# EasyEDA Pro project ProProject_运放实验_2024-09-24.epro, board PCB4_1
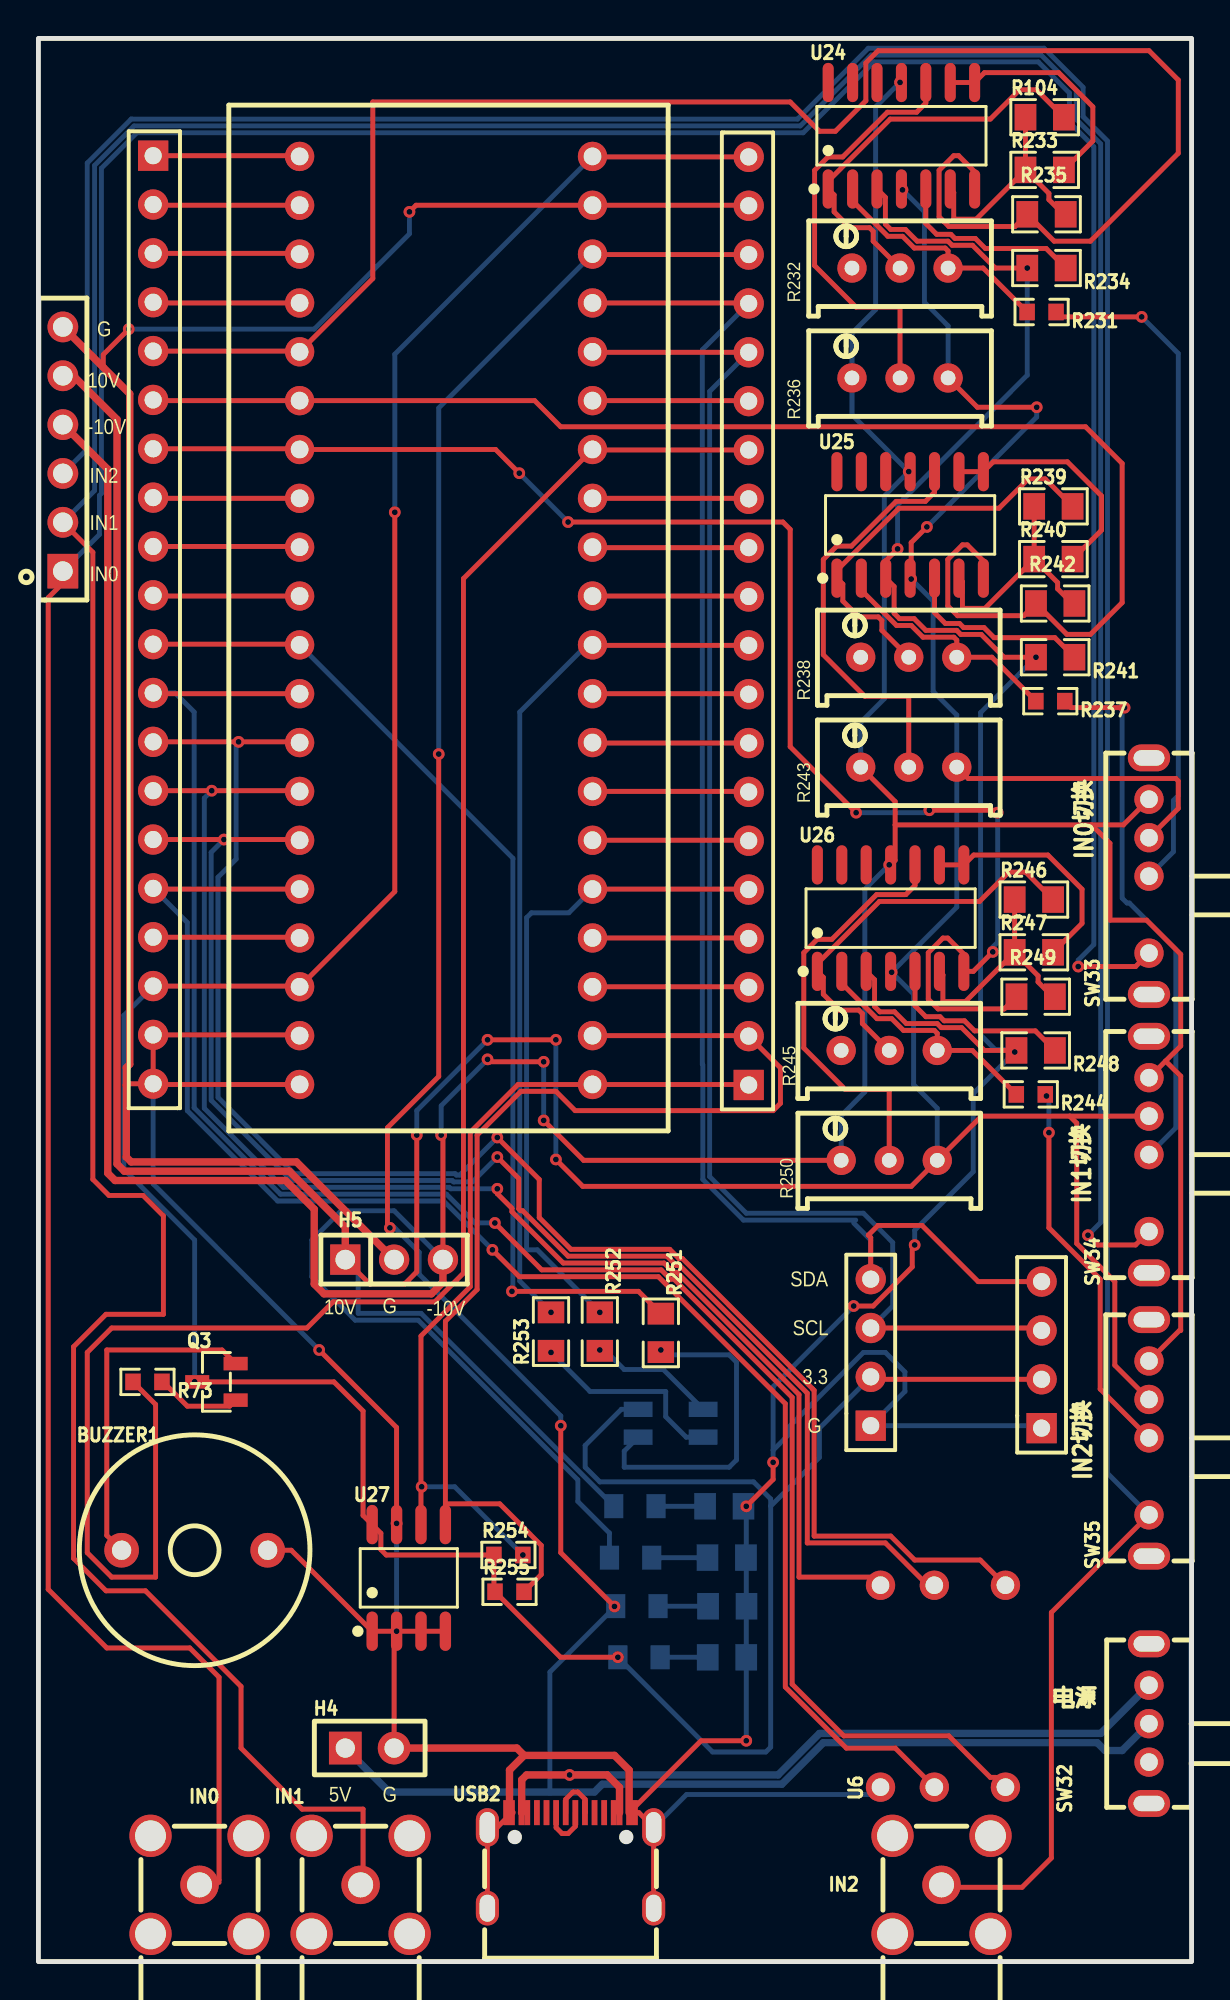
[diagram p5: board, top side]
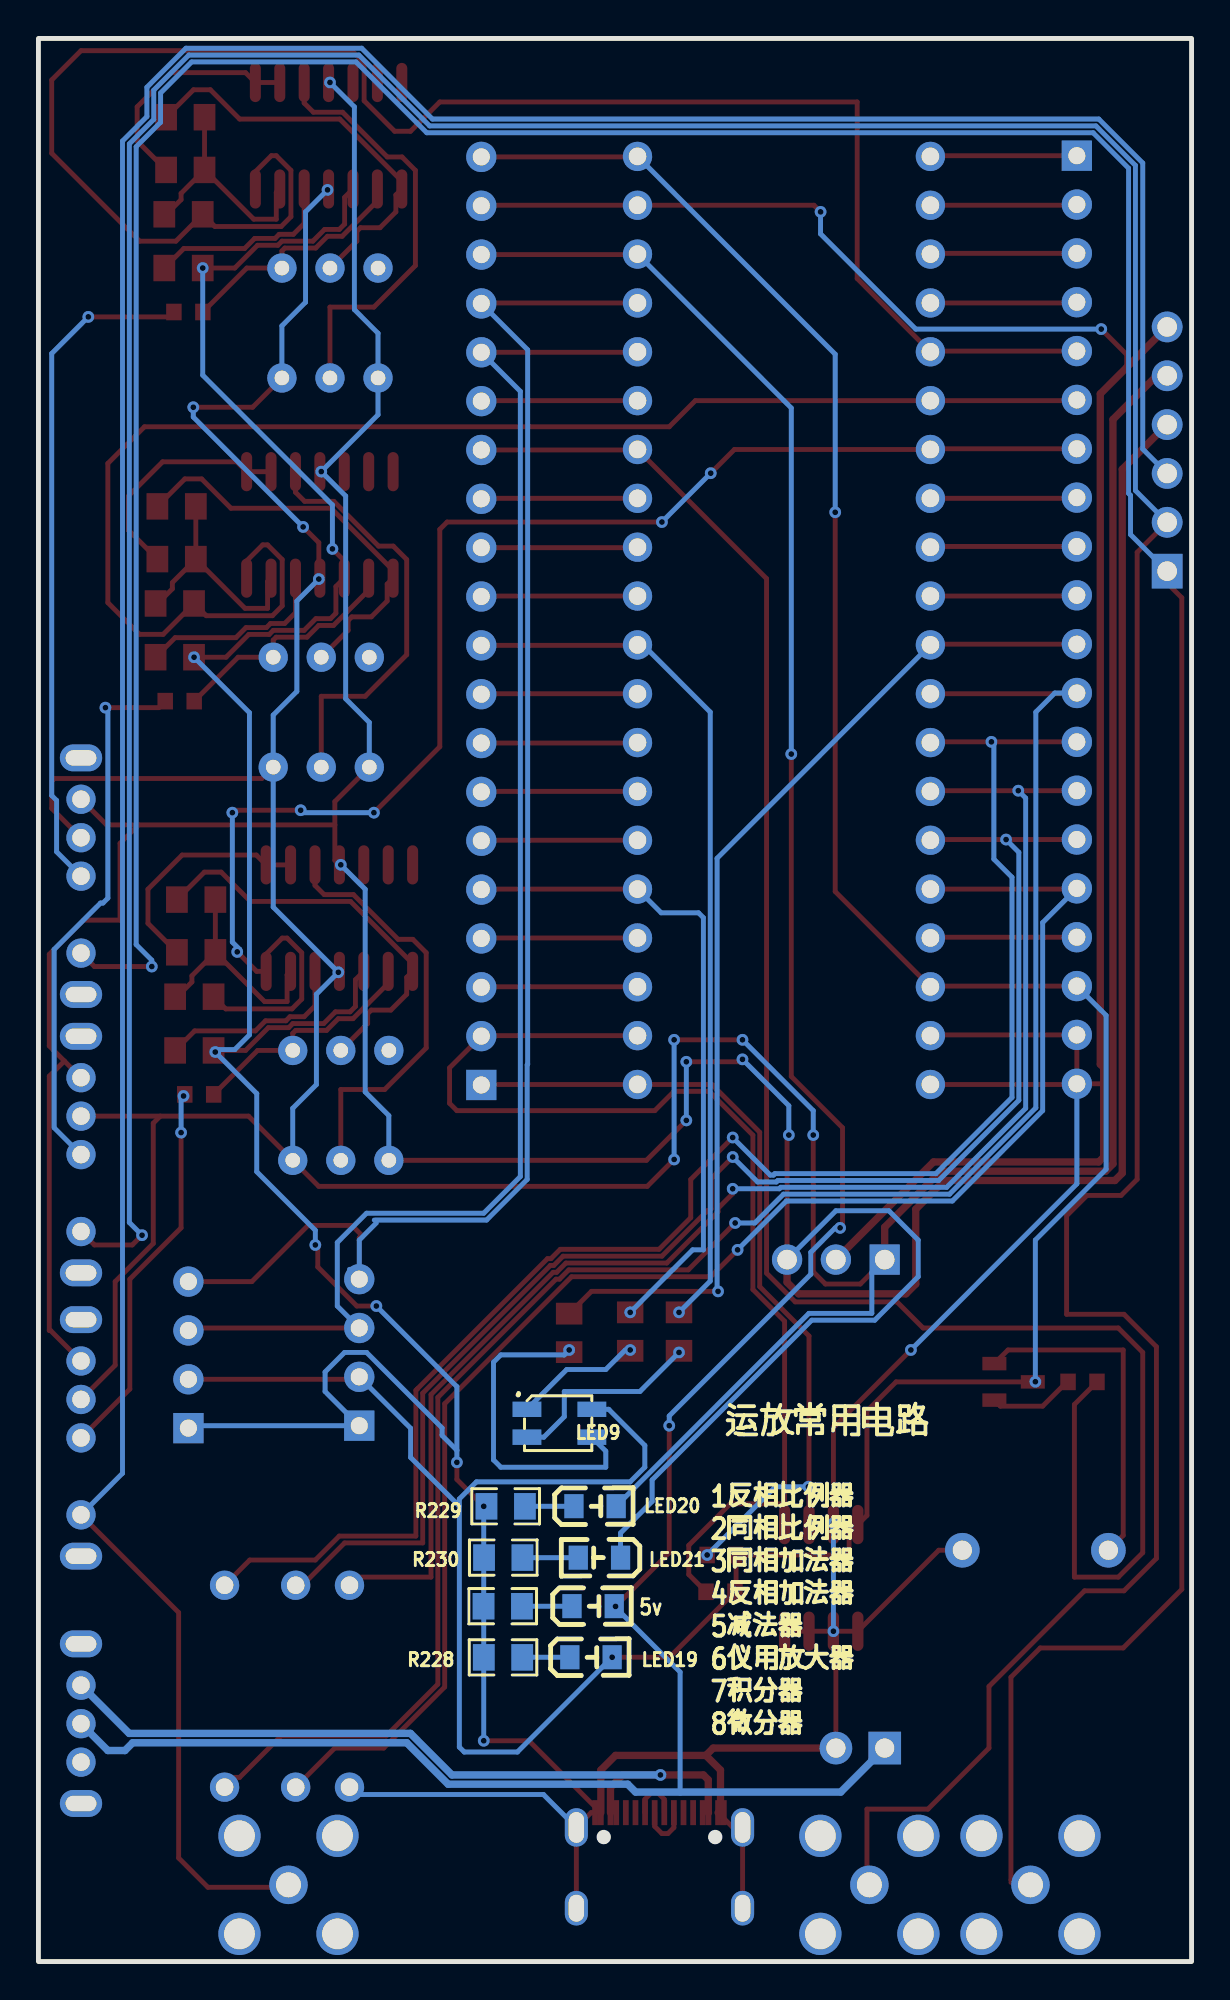
[diagram p6: board, bottom side, seen from below]

Outline 60 x 100 mm; copper layers: Top Layer, Bottom Layer. Coordinates in mm from the lower left corner of the outline.
Outline path: rectangle 0,100 60,0
Stack: Top Layer 0.035mm - / Dielectric1 1.51mm FR4 er 4.5 / Bottom Layer 0.035mm -

## Design rules (mm)
template: JLCPCB Capability(Two Layers Board)
spacing copperThickness1oz (default): track to track 0.102, other pairs 0.152 to 0.3
spacing copperThickness2oz: track to track 0.203, other pairs 0.152 to 0.3
track width copperThickness1oz (default): min 0.127, default 0.254, max 2.54
track width copperThickness2oz: min 0.203, default 0.254, max 2.54
differential pair differentialPair (default): width min 0.127, default 0.254, max 2.54; gap min 0.152, default 0.152
via viaSize (default): diameter min 0.5, default 0.61, max 10; hole min 0.3, default 0.305, max 6.3

## Placement (name value [footprint] x y rotation side)
BUZZER1  2.3kHz  [BUZ-TH_BD12.0-P7.60-D0.6-FD]  8.13 21.39 0 top
H2  PM254V-11-06-H85  [HDR-TH_6P-P2.54-V-F]  1.27 78.65 90 top
H3  HDR-F-2.54_1x4  [HDR-F-2.54_1X4]  43.31 31.67 90 top
H3#2  -  [HDR-F-2.54_1X4]  52.2 31.55 90 top
H4  -  [HDR-TH_2P-P2.54-V-F]  17.24 11.1 0 top
H5  -  [HDR-TH_3P-P2.54-V-F]  18.51 36.5 0 top
IN0  BWSMA-KWE-Z001  [SMA-TH_BWSMA-KWE-Z001]  8.38 3.99 270 top
IN1  BWSMA-KWE-Z001  [SMA-TH_BWSMA-KWE-Z001]  16.76 3.99 270 top
IN2  BWSMA-KWE-Z001  [SMA-TH_BWSMA-KWE-Z001]  46.99 3.99 270 top
J1  HDR-M-2.54_1x20  [HDR-M-2.54_1X20]  36.96 69.71 90 top
J2  HDR-M-2.54_1x20  [HDR-M-2.54_1X20]  5.97 69.77 270 top
LED9  LED-RGB-3528  [LED 3528-4PIN]  32.89 27.99 0 bottom
LED18  -  [LED_0805]  31.09 18.48 180 bottom
LED19  -  [LED_0805]  31.2 15.82 180 bottom
LED20  -  [LED_0805]  30.99 23.67 180 bottom
LED21  -  [LED_0805]  30.86 21.01 0 bottom
Q3  S8550  [SOT-23-3_L2.9-W1.3-P1.90-LS2.4-BR]  9.26 30.14 0 top
R73  1kΩ  [R0603]  5.67 30.14 180 top
R104  1k  [R0805]  52.36 95.91 0 top
R227  5k  [R0805]  35.84 18.48 180 bottom
R228  5k  [R0805]  35.83 15.82 180 bottom
R229  5k  [R0805]  35.69 23.67 180 bottom
R230  5k  [R0805]  35.81 21.01 180 bottom
R231  3.3kΩ  [R0603]  52.2 85.78 180 top
R232  1kΩ  [RES-ADJ-TH_3P-L10.0-W10.0-P2.50-BL-BS]  44.83 88.06 90 top
R233  1k  [R0805]  52.36 93.16 0 top
R234  1k  [R0805]  52.45 88.06 180 top
R235  1k  [R0805]  52.45 90.86 0 top
R236  5kΩ  [RES-ADJ-TH_3P-L9.5-W4.85-P2.50-BL-BS]  44.83 82.35 90 top
R237  3.3kΩ  [R0603]  52.65 65.54 180 top
R238  1kΩ  [RES-ADJ-TH_3P-L10.0-W10.0-P2.50-BL-BS]  45.28 67.83 90 top
R239  1k  [R0805]  52.81 75.67 0 top
R240  1k  [R0805]  52.81 72.93 0 top
R241  1k  [R0805]  52.9 67.83 180 top
R242  1k  [R0805]  52.9 70.62 0 top
R243  5kΩ  [RES-ADJ-TH_3P-L9.5-W4.85-P2.50-BL-BS]  45.28 62.11 90 top
R244  3.3kΩ  [R0603]  51.63 45.09 180 top
R245  1kΩ  [RES-ADJ-TH_3P-L10.0-W10.0-P2.50-BL-BS]  44.27 47.38 90 top
R246  1k  [R0805]  51.79 55.22 0 top
R247  1k  [R0805]  51.79 52.48 0 top
R248  1k  [R0805]  51.89 47.38 180 top
R249  1k  [R0805]  51.89 50.17 0 top
R250  5kΩ  [RES-ADJ-TH_3P-L9.5-W4.85-P2.50-BL-BS]  44.27 41.66 90 top
R251  1k  [R0805]  32.38 32.69 270 top
R252  1k  [R0805]  29.21 32.76 270 top
R253  1k  [R0805]  26.67 32.76 90 top
R254  10kΩ  [R0603]  24.45 21.14 0 top
R255  10kΩ  [R0603]  24.51 19.23 0 top
SW32  SK12D07VG4  [SW-TH_SK12D07VG4]  57.78 12.37 90 top
SW33  SK13D07VG4  [SW-TH_SK13D07VG4]  57.78 56.44 90 top
SW34  SK13D07VG4  [SW-TH_SK13D07VG4]  57.78 41.96 90 top
SW35  SK13D07VG4  [SW-TH_SK13D07VG4]  57.78 27.23 90 top
U6  -  [直插五向开关]  43.81 9.07 90 top
U23  STM32最小系统-fh  [STM32最小系统板]  20.7 69.74 90 top
U24  LM324DT  [SOIC-14_L8.7-W3.9-P1.27-LS6.0-BL]  44.9 94.94 0 top
U25  LM324DT  [SOIC-14_L8.7-W3.9-P1.27-LS6.0-BL]  45.36 74.7 0 top
U26  LM324DT  [SOIC-14_L8.7-W3.9-P1.27-LS6.0-BL]  44.34 54.26 0 top
U27  M24C02-WMN6TP  [SOIC-8_L4.9-W3.9-P1.27-LS6.0-BL]  19.27 19.95 0 top
USB2  -  [USB-C_SMD-TYPE-C-31-M-12]  27.69 5.26 0 top

## Footprints (pads in the part's own frame, mm; a bottom-side part is the same pattern mirrored in y, then rotated)
BUZ-TH_BD12.0-P7.60-D0.6-FD
  round 1.8 hole 1: 1(-3.8,0) 2(3.8,0)
HDR-F-2.54_1X4
  rect 1.575x1.575 hole 0.889: 1(-3.81,0)
  round 1.575 hole 0.889: 2(-1.27,0) 3(1.27,0) 4(3.81,0)
HDR-M-2.54_1X20
  rect 1.575x1.575 hole 0.889: 1(-24.13,0)
  round 1.575 hole 0.889: 2(-21.59,0) 3(-19.05,0) 4(-16.51,0) 5(-13.97,0) 6(-11.43,0) 7(-8.89,0) 8(-6.35,0) 9(-3.81,0) 10(-1.27,0) 11(1.27,0) 12(3.81,0) 13(6.35,0) 14(8.89,0) 15(11.43,0) 16(13.97,0) 17(16.51,0) 18(19.05,0) 19(21.59,0) 20(24.13,0)
HDR-TH_2P-P2.54-V-F
  rect 1.7x1.7 hole 1: 1(-1.27,0)
  round 1.7 hole 1: 2(1.27,0)
HDR-TH_3P-P2.54-V-F
  rect 1.575x1.575 hole 1.02: 1(-2.54,0)
  round 1.575 hole 1.02: 2(0,0) 3(2.54,0)
HDR-TH_6P-P2.54-V-F
  rect 1.8x1.6 hole 1.02: 1(-6.35,0)
  round 1.6 hole 1.02: 2(-3.81,0) 3(-1.27,0) 4(1.27,0) 5(3.81,0) 6(6.35,0)
LED 3528-4PIN
  custom 1.5x0.8 smd: 1(1.689,-0.725) 2(-1.689,-0.725) 3(-1.689,0.725) 4(1.689,0.725)
LED_0805
  rect 1x1.25 smd: 1(-1.15,0.005) 2(1.05,0.005)
R0603
  rect 0.806x0.864 smd: 1(-0.753,0) 2(0.753,0)
R0805
  rect 1.133x1.377 smd: 1(-1,0) 2(1,0)
RES-ADJ-TH_3P-L9.5-W4.85-P2.50-BL-BS
  round 1.524 hole 0.762: 1(0,2.5) 2(0,0) 3(0,-2.5)
RES-ADJ-TH_3P-L10.0-W10.0-P2.50-BL-BS
  round 1.524 hole 0.762: 1(0,2.5) 2(0,0) 3(0,-2.5)
SMA-TH_BWSMA-KWE-Z001
  round 2.2 hole 1.6: 1(-2.55,-2.55) 2(-2.55,2.55) 3(2.55,2.55) 4(2.55,-2.55)
  round 2 hole 1.3: 5(0,0)
SOIC-8_L4.9-W3.9-P1.27-LS6.0-BL
  oval 0.588x2.045 smd: 1(-1.905,-2.772) 2(-0.635,-2.772) 3(0.635,-2.772) 4(1.905,-2.772) 5(1.905,2.772) 6(0.635,2.772) 7(-0.635,2.772) 8(-1.905,2.772)
SOIC-14_L8.7-W3.9-P1.27-LS6.0-BL
  oval 0.574x2.038 smd: 1(-3.81,-2.769) 2(-2.54,-2.769) 3(-1.27,-2.769) 4(0,-2.769) 5(1.27,-2.769) 6(2.54,-2.769) 7(3.81,-2.769) 8(3.81,2.769) 9(2.54,2.769) 10(1.27,2.769) 11(0,2.769) 12(-1.27,2.769) 13(-2.54,2.769) 14(-3.81,2.769)
SOT-23-3_L2.9-W1.3-P1.90-LS2.4-BR
  rect 1.25x0.7 smd: 1(1,-0.95) 2(1,0.95) 3(-1,0)
STM32最小系统板
  round 1.524 hole 0.919x0.914: 1(-24.13,7.112) 2(-21.59,7.112) 3(-19.05,7.112) 4(-16.51,7.112) 5(-13.97,7.112) 6(-11.43,7.112) 7(-8.89,7.112) 8(-6.35,7.112) 9(-3.81,7.112) 10(-1.27,7.112) 11(1.27,7.112) 12(3.81,7.112) 13(6.35,7.112) 14(8.89,7.112) 15(11.43,7.112) 16(13.97,7.112) 17(16.51,7.112) 18(19.05,7.112) 19(21.59,7.112) 20(24.13,7.112) 21(24.13,-8.128) 22(21.59,-8.128) 23(19.05,-8.128) 24(16.51,-8.128) 25(13.97,-8.128) 26(11.43,-8.128) 27(8.89,-8.128) 28(6.35,-8.128) 29(3.81,-8.128) 30(1.27,-8.128) 31(-1.27,-8.128) 32(-3.81,-8.128) 33(-6.35,-8.128) 34(-8.89,-8.128) 35(-11.43,-8.128) 36(-13.97,-8.128) 37(-16.51,-8.128) 38(-19.05,-8.128) 39(-21.59,-8.128) 40(-24.13,-8.128)
SW-TH_SK12D07VG4
  round 1.524 hole 0.914: 1(-2,0) 2(0,0) 3(2,0)
  oval 1.4x2.2 hole 0.8x1.6: 4(4.15,0) 5(-4.15,0)
SW-TH_SK13D07VG4
  round 1.524 hole 0.914: 1(-4,0) 3(0,0) 4(2,0) 5(4,0)
  oval 1.4x2.2 hole 0.8x1.6: 6(6.15,0) 7(-6.15,0)
USB-C_SMD-TYPE-C-31-M-12
  oval 1.2x2 hole 0.8x1.6: 0(-4.325,1.716) 0(4.325,1.716)
  oval 1.2x1.8 hole 0.8x1.4: 0(-4.325,-2.484) 0(4.325,-2.484)
  rect 0.3x1.3 smd: A1(-3.35,2.484) A4(-2.55,2.484) A5(-1.25,2.484) A6(-0.25,2.484) A7(0.25,2.484) A8(1.25,2.484) A9(2.55,2.484) A12(3.35,2.484) B1(3.05,2.484) B4(2.25,2.484) B5(1.75,2.484) B6(0.75,2.484) B7(-0.75,2.484) B8(-1.75,2.484) B9(-2.25,2.484) B12(-3.05,2.484)
直插五向开关
  round 1.524 hole 0.914: 1(0,0) 2(0,-2.8) 3(0,-6.5) 4(10.5,0) 5(10.5,-2.8) 6(10.5,-6.5)

## Nets
As in the schematic, except:
3.3V: H3.2 H3#2.2 J1.20 J2.18 LED9.2 LED19.2 Q3.3 R254.1 R255.1 U23.3 U23.21 U27.8
GND: BUZZER1.2 H2.6 H3.1 H3#2.1 H4.2 H5.2 IN0.1 IN0.2 IN0.3 IN0.4 IN1.1 IN1.2 IN1.3 IN1.4 IN2.1 IN2.2 IN2.3 IN2.4 J1.19 J2.19 J2.20 R227.1 R228.1 R229.1 R230.1 R234.2 R241.2 R248.2 U6.1 U23.1 U23.2 U23.22 U24.3 U25.3 U26.3 U27.1 U27.2 U27.3 U27.4 U27.7 USB2.0 USB2.A1 USB2.A12 USB2.B1 USB2.B12
B8: H3.3 H3#2.3 J1.16 U23.25
B9: H3.4 H3#2.4 J1.17 U23.24
IN0: H2.1 IN0.5 SW33.1
IN1: H2.2 IN1.5 SW34.1
IN2: H2.3 IN2.5 SW35.1

Pads without a net: R232 1; R238 1; R245 1; SW32 1 4 5; SW33 6 7; SW34 6 7; SW35 6 7; U24 12 13 14; U25 12 13 14; U26 12 13 14; USB2 A5 A8 B5 B8

## Via types
v1: diameter 0.61, hole 0.305, Top Layer to Bottom Layer, 66 vias

## Routing (per net, layer and track width the routed paths; a pad name or vN(x,y) marks a point on that pad's centre or on a via; arc(x,y) is an arc through that point)
3.3V: length 176.5
  Top Layer w0.254: v1(8.13,30.15) 8.14,30.14 Q3.3 15.37,30.14 16.89,28.63 16.89,23.2 U27.8 17.82,22.27 17.82,21.42 18.1,21.14 R254.1 23.7,19.29 R255.1 27.16,15.82 v1(30.15,15.82) ; H3#2.2 43.43,30.28 H3.2 ; J2.18 13.55,50.72 U23.3 18.54,55.64 v1(18.54,75.36) ; J1.20 28.85,93.84 28.83,93.87
  Bottom Layer w0.254: v1(8.13,30.15) 8.13,37.52 4.44,41.2 4.44,49.2 J2.18 ; 38.1,23.68 40.63,26.21 40.63,27.73 H3.2 ; 38.1,23.68 38.1,24.05 37.21,24.94 29.21,24.94 28.45,25.71 28.45,26.84 30.33,28.72 LED9.2 ; 38.1,23.68 38.1,11.15 37.85,10.9 35.08,10.9 v1(30.15,15.82) ; 28.83,93.87 18.54,83.58 v1(18.54,75.36)
5V: length 143.6
  Top Layer w0.254: 28.83,88.79 28.85,88.76 J1.18 ; v1(18.29,38.15) 18.16,38.28 18.16,43.36 20.83,46.03 v1(20.83,62.79) ; v1(27.18,27.86) 27.18,21.26 v1(29.97,18.47)
  Bottom Layer w0.254: 30.02,18.47 26.61,15.06 26.61,8.81 ; 30.02,18.47 v1(29.97,18.47) ; 30.02,18.47 LED18.2 ; v1(18.29,38.15) 18.54,38.15 19.81,36.88 19.81,35.74 27.18,28.37 v1(27.18,27.86) ; 28.83,88.79 20.83,80.79 v1(20.83,62.79)
  Bottom Layer w0.381: 15.97,11.1 18.25,8.81 28.93,8.81 29.34,9.22 38.68,9.22 40.84,11.38 55.09,11.38 55.5,10.97 56.39,10.97 SW32.2
10V: length 232.1
  Top Layer w0.254: SW33.4 59.31,59.96 59.31,61.39 59.18,61.52 48.38,61.52 R243.3 ; R236.3 48.85,80.82 v1(51.94,80.82) ; U25.4 45.37,71.94 v1(45.41,71.89) 45.41,73.78 v1(46.23,74.6) ; 53.66,43.96 49.07,43.96 R250.3 45.41,40.31 28.32,40.31 v1(26.92,41.71) ; 53.66,43.96 SW34.4 ; 53.66,43.96 54.03,43.59 54.03,37.34 56.01,35.36 56.01,31.01 SW35.4 ; v1(44.96,92.13) 44.91,92.17 U24.4 ; H5.1 17.24,35.23 19.05,35.23 19.69,35.86 v1(19.69,42.98) ; U26.4 44.35,51.49 v1(44.4,51.44) ; v1(26.92,47.93) v1(23.37,47.93)
  Top Layer w0.381: H2.5 1.82,82.46 4.09,80.19 4.09,41.48 4.47,41.1 13.06,41.1 15.97,38.19 H5.1
  Bottom Layer w0.254: R250.3 46.77,44.37 45.54,45.6 45.54,50.3 v1(44.4,51.44) 47.78,54.83 R243.3 47.78,64.82 46.55,66.05 46.55,70.75 v1(45.41,71.89) ; v1(19.69,42.98) 19.69,44.25 v1(23.37,47.93) ; v1(44.96,92.13) 46.1,90.98 46.1,86.28 47.33,85.05 R236.3 ; v1(51.94,80.82) 51.94,80.31 v1(46.23,74.6) ; v1(26.92,41.71) v1(26.92,47.93) ; H5.1 16.64,35.83 16.64,33.71 19.91,33.71 LED20.2
-10V: length 239.5
  Top Layer w0.254: 54.79,59.11 56.45,59.11 SW33.5 ; 54.79,59.11 44.58,59.11 ; 54.79,59.11 55.75,58.15 55.75,54.15 57.66,54.15 59.44,52.38 59.44,47.61 58.65,46.83 ; 44.58,59.11 44.58,60.32 R243.1 ; 44.58,59.11 44.58,57.26 U26.11 44.34,57.03 v1(44.27,57.03) ; v1(45.28,77.48) 45.35,77.48 U25.11 ; v1(20.96,42.98) 21.05,42.89 H5.3 ; SW35.5 59.37,32.82 59.44,32.82 59.44,46.04 58.65,46.83 ; 58.65,46.83 SW34.5 ; v1(26.29,46.79) 23.5,46.79 v1(23.37,46.91) ; v1(26.29,43.74) 28.37,41.66 R250.1 ; v1(44.83,97.71) 44.9,97.71 U24.11
  Top Layer w0.381: H2.4 1.28,79.92 3.61,77.6 3.61,41 3.99,40.61 12.86,40.61 14.35,39.12 14.35,35.23 14.86,34.72 20.45,34.72 21.05,35.32 H5.3
  Bottom Layer w0.254: v1(44.27,57.03) 43,55.76 43,45.22 41.77,43.99 R250.1 ; v1(20.96,42.98) 20.96,44.5 v1(23.37,46.91) ; 29.71,21 29.71,22.28 28.07,23.93 28.07,25.05 19.76,33.35 16.49,33.35 14.22,35.61 14.22,37.52 15.75,39.04 18.51,39.04 H5.3 ; R243.1 42.78,64.44 44.01,65.67 44.01,76.21 v1(45.28,77.48) 42.33,80.43 R236.1 42.33,84.67 43.56,85.9 43.56,96.44 v1(44.83,97.71) ; v1(26.29,43.74) v1(26.29,46.79)
GND: length 356.7
  Top Layer w0.254: U27.7 v1(18.64,22.78) 18.64,27.77 v1(14.6,31.8) ; U26.3 43.51,51.05 43.51,49.66 43.78,49.39 44.55,49.39 45.16,48.78 46.76,48.78 46.98,48.56 48.04,48.56 49.22,47.38 R248.2 50.81,47.3 v1(50.8,47.3) ; USB2.A12 31.24,7.74 USB2.0 USB2.0 ; J2.20 6.01,45.61 U23.1 ; J2.20 4.65,45.64 4.57,45.57 ; J2.20 J2.19 13.55,48.18 13.59,48.15 ; v1(44.7,73.46) 44.09,72.84 U25.3 44.52,71.5 44.52,70.11 44.8,69.83 45.56,69.83 46.17,69.22 47.78,69.22 47.99,69.01 49.05,69.01 50.24,67.83 v1(51.9,67.83) ; USB2.B1 34.47,11.48 v1(36.83,11.48) ; v1(18.64,17.18) U27.3 U27.4 ; v1(18.64,17.18) 18.51,17.05 H4.2 ; v1(18.64,17.18) U27.1 13.16,21.39 BUZZER1.2 ; v1(38.23,25.96) 38.23,25.07 v1(36.83,23.67) ; v1(19.3,90.98) 19.65,91.33 U23.22 36.93,91.33 J1.19 ; v1(4.7,84.89) 3.37,83.56 3.37,82.9 ; v1(45.59,37.26) 45.47,37.14 45.47,36.12 43.43,34.09 v1(42.42,34.09) ; U24.3 44.07,91.74 44.07,90.35 44.35,90.07 45.11,90.07 45.72,89.46 47.33,89.46 47.54,89.25 48.6,89.25 49.78,88.06 v1(51.45,88.06) ; 23.36,2.77 23.36,6.97 23.87,6.97 USB2.B12
  Top Layer w0.381: H4.2 24.89,11.1 25.27,10.72 ; USB2.B1 30.74,9.96 29.97,10.72 25.27,10.72 ; 25.27,10.72 24.51,9.96 24.51,7.87 USB2.B12 ; H2.6 4.75,81.52 4.75,46.66 4.57,46.48 4.57,41.83 4.83,41.58 13.43,41.58 H5.2
  Bottom Layer w0.254: v1(45.59,37.26) 45.59,38.02 48.64,41.07 48.64,45.14 v1(50.8,47.3) 50.67,47.42 49.78,47.42 49.02,48.18 49.02,64.94 v1(51.9,67.83) ; v1(36.83,11.48) 36.83,23.53 R229.1 v1(36.83,23.67) ; v1(19.3,90.98) 19.3,89.84 14.35,84.89 v1(4.7,84.89) ; v1(18.64,17.18) v1(18.64,22.78) ; v1(14.6,31.8) 5.97,40.44 J2.20 ; v1(44.7,73.46) 44.7,75.74 51.45,82.49 v1(51.45,88.06) ; U6.1 43.43,8.69 33.72,8.69 USB2.0 ; 38.23,26.59 38.23,29.9 v1(42.42,34.09) ; 38.23,26.59 v1(38.23,25.96) ; 38.23,26.59 39,27.36 39,27.75 42.93,31.67 44.07,31.67 45.09,30.66 45.09,29.64 H3.1 52.07,27.86 H3#2.1
A0: length 93.3
  Top Layer w0.254: J2.5 13.55,83.74 U23.16 17.4,87.52 17.4,96.7 39.12,96.7 40.64,95.17 41.47,95.17 43.05,96.76 43.05,98.73 43.69,99.37 57.78,99.37 59.31,97.84 59.31,94.03 54.74,89.46 52.85,89.46 R235.1 50.82,90.22 47.37,90.22 46.86,90.73 46.86,93.14 47.62,93.9 47.88,93.9 48.71,93.07 U24.7
A1: length 75.7
  Top Layer w0.254: U25.7 49.17,72.83 48.33,73.67 48.08,73.67 47.32,72.91 47.32,70.49 47.82,69.98 51.27,69.98 R242.1 53.51,69.01 54.74,69.01 56.39,70.66 56.39,77.9 54.48,79.81 27.18,79.81 25.82,81.17 U23.15 6.01,81.17 J2.6
A2: length 78.8
  Top Layer w0.254: v1(25.02,77.39) 23.79,78.63 U23.14 13.55,78.66 J2.7 ; v1(46.35,59.87) 49.78,59.87 v1(49.91,59.74) ; v1(49.66,52.5) 48.64,51.49 U26.7 48.15,52.39 47.32,53.22 47.06,53.22 46.3,52.46 46.3,50.05 46.81,49.54 50.25,49.54 R249.1 ; v1(42.54,59.74) 39.12,63.17 39.12,74.47 38.74,74.85 v1(27.56,74.85)
  Bottom Layer w0.254: v1(49.66,52.5) 49.53,52.63 49.91,53.01 v1(49.91,59.74) ; v1(25.02,77.39) v1(27.56,74.85) ; v1(42.54,59.74) 46.23,59.74 v1(46.35,59.87)
A3: length 7.6
  Top Layer w0.254: 13.59,76.09 6.01,76.09 J2.8
A4: length 7.6
  Top Layer w0.254: U23.12 13.55,73.58 J2.9
A5: length 7.6
  Top Layer w0.254: J2.10 6.01,71.01 13.59,71.01
A6: length 54.1
  Top Layer w0.254: v1(24.64,34.85) 31.23,34.85 R251.1 ; U23.10 13.55,68.5 J2.11
  Bottom Layer w0.254: v1(24.64,34.85) 24.69,34.9 24.69,57.37 U23.10
A7: length 96.3
  Top Layer w0.254: U6.3 49.81,9.58 49.53,9.58 47.37,11.73 41.91,11.73 39.22,14.42 39.22,29.34 33.07,35.48 32.89,35.48 32.41,35.97 26.19,35.97 v1(23.75,38.41) ; J2.12 6.01,65.93 13.59,65.93
  Bottom Layer w0.254: v1(23.75,38.41) 22.73,38.41 21.23,39.9 12.59,39.9 8.1,44.39 8.1,64.97 7.11,65.96 J2.12
A8: length 34.6
  Top Layer w0.254: U23.36 36.93,55.77 J1.5
  Bottom Layer w0.254: v1(29.21,33.76) 25.96,37.01 25.4,37.01 25.4,54.28 25.65,54.53 27.6,54.53 U23.36
A9: length 8.1
  Top Layer w0.254: 28.83,58.31 36.93,58.31 J1.6
A10: length 8.1
  Top Layer w0.254: U23.34 36.93,60.85 J1.7
A11: length 8.1
  Top Layer w0.254: U23.33 28.85,63.36 J1.8
A12: length 8.1
  Top Layer w0.254: J1.9 36.93,65.93 28.83,65.93
A15: length 45.3
  Top Layer w0.254: J1.10 28.85,68.44 U23.31
  Bottom Layer w0.254: U23.31 28.54,68.47 25.04,64.97 25.04,35.38 v1(26.67,33.76)
B0: length 85.3
  Top Layer w0.254: U6.6 49,20.88 45.59,20.88 44.35,22.12 40.36,22.12 40.36,29.7 40.29,29.77 40.29,29.78 33.51,36.55 33.33,36.55 32.85,37.03 27.71,37.03 26.06,38.68 26.06,40.67 v1(23.88,42.85) ; U23.8 13.55,63.42 v1(10.41,63.42) J2.13
  Bottom Layer w0.254: v1(23.88,42.85) 21.92,40.89 21.75,40.89 21.68,40.97 13.3,40.97 9.34,44.93 9.34,56.38 10.29,57.33 10.29,63.3 v1(10.41,63.42)
B1: length 75.6
  Top Layer w0.254: U6.4 43.39,19.99 39.57,19.99 39.57,29.48 33.22,35.84 33.04,35.84 32.55,36.32 27.31,36.32 24.64,38.99 24.64,39.17 23.88,39.93 v1(23.88,40.18) ; U23.7 13.55,60.88 v1(9.02,60.88) J2.14
  Bottom Layer w0.254: v1(23.88,40.18) 21.45,40.18 21.38,40.26 12.74,40.26 8.63,44.37 8.63,60.5 v1(9.02,60.88)
B3: length 8.1
  Top Layer w0.254: J1.11 36.93,71.01 28.83,71.01
B4: length 8.1
  Top Layer w0.254: U23.29 28.85,73.52 J1.12
B5: length 8.1
  Top Layer w0.254: J1.13 36.93,76.09 28.83,76.09
B6: length 100.2
  Top Layer w0.254: J1.14 28.85,78.6 U23.27 22.11,71.91 22.11,35.8 20.62,34.3 15.33,34.3 13.97,32.94 3.81,32.94 2.54,31.67 2.54,21.26 3.81,19.99 6.1,19.99 6.1,28.97 R73.2
B7: length 8.1
  Top Layer w0.254: U23.26 36.93,81.17 J1.15
B8: length 76.9
  Top Layer w0.254: H3.3 52.07,32.94 H3#2.3 ; U23.25 28.85,83.68 J1.16
  Bottom Layer w0.254: 43.56,32.94 H3.3 44.45,34.09 44.45,37.39 42.93,38.91 36.83,38.91 34.93,40.82 34.93,81.65 J1.16
B9: length 80.3
  Top Layer w0.254: H3#2.4 48.9,35.36 45.97,38.28 43.69,38.28 43.18,37.77 43.31,37.64 H3.4 ; U23.24 36.93,86.25 J1.17
  Bottom Layer w0.254: 42.52,38.56 36.68,38.56 34.57,40.67 34.57,46.64 34.54,46.66 34.54,83.81 J1.17 ; 43.81,35.99 H3.4 43.31,37.52 42.42,38.41
B10: length 76.1
  Top Layer w0.254: U6.5 46.27,19.57 44.07,21.77 40,21.77 40,29.56 33.37,36.2 33.18,36.2 32.7,36.68 27.56,36.68 25.2,39.04 25.09,39.04 24.99,39.14 24.99,40.72 v1(23.88,41.83) ; J2.15 v1(9.65,58.34) 13.55,58.34 13.59,58.31
  Bottom Layer w0.254: v1(9.65,58.34) 8.99,57.68 8.99,44.78 13.16,40.62 21.53,40.62 21.6,40.54 22.58,40.54 v1(23.88,41.83)
B11: length 82
  Top Layer w0.254: J2.16 6.01,55.77 U23.5 ; U6.2 44.58,11.1 42.04,11.1 38.86,14.28 38.86,29.01 32.26,35.61 25.02,35.61 v1(23.62,37.01)
  Bottom Layer w0.254: J2.16 7.75,54.03 7.75,44.25 12.45,39.55 21.08,39.55 v1(23.62,37.01)
B12: length 43.8
  Top Layer w0.254: v1(19.94,24.69) 19.93,24.69 19.91,24.66 ; 19.91,24.66 19.91,32.53 22.47,35.09 22.47,43.12 24.96,45.61 U23.40 36.93,45.61 J1.1 ; 19.91,24.66 U27.6
  Bottom Layer w0.254: v1(19.94,24.69) 21.66,24.69 v1(25.21,21.14)
B13: length 59.2
  Top Layer w0.254: 21.18,23.8 21.18,33.3 22.82,34.95 22.82,42.97 25.1,45.25 26.92,45.25 27.93,44.25 38.23,44.25 38.61,44.63 38.61,46.47 J1.2 36.93,48.15 28.83,48.15 ; 21.18,23.8 24,23.8 26.16,21.64 26.16,20.13 R255.2 ; 21.18,23.8 U27.5
B14: length 8.1
  Top Layer w0.254: J1.3 36.93,50.69 U23.38
B15: length 8.1
  Top Layer w0.254: J1.4 36.93,53.23 28.83,53.23
C13: length 7.6
  Top Layer w0.254: J2.2 6.01,91.33 U23.19
C14: length 7.6
  Top Layer w0.254: U23.18 13.55,88.82 J2.3
C15: length 7.6
  Top Layer w0.254: J2.4 6.01,86.25 U23.17
D+: length 2.7
  Top Layer w0.254: USB2.B6 28.45,7.75 28.45,8.43 28.07,8.81 27.81,8.81 27.44,8.44 USB2.A6
D-: length 2.8
  Top Layer w0.254: USB2.B7 26.94,6.97 27.25,6.66 27.56,6.66 27.94,7.03 USB2.A7
IN0: length 201.2
  Top Layer w0.254: 9.27,4.12 8.76,3.61 8.51,3.61 ; 9.27,4.12 9.4,4.24 9.4,14.78 7.87,16.31 3.56,16.31 0.51,19.35 0.51,70.92 1.27,71.68 H2.1 ; 9.27,4.12 9.4,4.12 ; SW33.1 57.09,51.74 v1(54.1,51.74)
  Bottom Layer w0.254: v1(54.1,51.74) 54.1,52.07 54.91,52.88 54.91,94.37 53.64,95.64 53.64,97.16 52.03,98.78 43.47,98.78 39.79,95.1 5.12,95.1 3.28,93.25 3.28,76.34 3.17,76.24 3.17,74.2 H2.1
IN1: length 224.3
  Top Layer w0.254: v1(54.61,37.77) 55.12,37.26 57.09,37.26 SW34.1 ; H2.2 2.83,73.28 2.83,40.67 3.67,39.84 5.44,39.84 6.5,38.78 6.5,33.66 3.52,33.66 1.83,31.97 1.83,20.97 3.52,19.28 5.57,19.28 10.54,14.3 10.54,11.1 13.72,7.93 16.89,7.93 16.89,4.16
  Bottom Layer w0.254: H2.2 2.92,76.49 2.92,93.4 4.97,95.45 39.64,95.45 43.33,99.14 52.18,99.14 54,97.31 54,95.79 55.27,94.52 55.27,38.43 v1(54.61,37.77)
IN2: length 173.6
  Top Layer w0.254: SW35.1 52.71,18.15 52.71,5.38 51.18,3.86 47.12,3.86
  Bottom Layer w0.254: SW35.1 55.63,25.39 55.63,94.67 54.36,95.94 54.36,97.46 52.32,99.49 43.18,99.49 39.5,95.81 4.83,95.81 2.54,93.52 2.54,78.65 H2.3
RST: length 7.6
  Top Layer w0.254: 13.59,53.23 13.55,53.26 J2.17
VBT: length 7.6
  Top Layer w0.254: 13.59,93.87 13.55,93.9 J2.1
VUSB: length 40.6
  Top Layer w0.381: USB2.A4 25.15,7.75 25.15,9.45 25.4,9.7 v1(27.64,9.7) 29.59,9.7 30.24,9.06 USB2.A9
  Bottom Layer w0.381: SW32.3 55.28,11.86 40.64,11.86 38.48,9.7 v1(27.64,9.7)
$1N26843: length 2.6
  Bottom Layer w0.254: R227.2 32.24,18.48 LED18.1
$1N34324: length 2.5
  Bottom Layer w0.254: R228.2 34.82,15.82 LED19.1
$1N34388: length 2.6
  Bottom Layer w0.254: LED20.1 32.14,23.67 R229.2
$1N34463: length 2.9
  Bottom Layer w0.254: R230.2 34.81,21 LED21.2
$1N35600: length 12.6
  Top Layer w0.254: U24.2 42.36,91.55 44.2,89.71 44.96,89.71 45.57,89.1 47.18,89.1 47.33,88.95 R232.3 49.16,88.06 R231.2
$1N35703: length 21.5
  Top Layer w0.254: R104.2 51.93,97.33 51.05,97.33 49.53,95.81 44.32,95.81 41.09,92.58 U24.1 41.4,91.86 41.4,90.98 42.22,90.16 43.25,90.16 43.43,89.97 43.43,89.46 R232.2
$1N35742: length 10
  Top Layer w0.254: U24.5 46.17,90.38 46.74,89.81 47.47,89.81 47.69,89.6 48.75,89.6 49.27,89.08 52.44,89.08 R234.1
$1N35778: length 12.4
  Top Layer w0.254: 47.44,92.17 47.62,91.99 47.62,90.6 48.8,90.6 R233.1 ; R104.1 R233.1 ; R233.1 52.58,91.94 52.58,91.62 53.34,90.86 R235.2
$1N35814: length 12.3
  Top Layer w0.254: 47.44,97.71 U24.8 49.22,98.22 53.09,98.22 54.86,96.44 54.86,94.67 R233.2
$1N35912: length 22.3
  Top Layer w0.254: U24.10 46.17,96.64 45.69,96.16 44.17,96.16 41.85,93.84 41.08,93.84 40.39,93.14 40.39,88.19 42.54,86.03 44.83,86.03 R236.2
$1N36717: length 12.6
  Top Layer w0.254: U25.2 42.82,71.31 44.65,69.48 45.42,69.48 46.03,68.87 47.63,68.87 47.78,68.71 R238.3 49.61,67.83 R237.2
$1N36723: length 21.5
  Top Layer w0.254: R239.2 52.38,77.1 51.51,77.1 49.98,75.57 44.77,75.57 41.55,72.34 U25.1 41.85,71.63 41.85,70.75 42.68,69.92 43.7,69.92 43.89,69.73 43.89,69.22 R238.2
$1N36728: length 10
  Top Layer w0.254: U25.5 46.63,70.14 47.19,69.58 47.93,69.58 48.14,69.37 49.2,69.37 49.72,68.84 52.89,68.84 R241.1
$1N36732: length 12.4
  Top Layer w0.254: U25.6 48.08,71.75 48.08,70.36 49.25,70.36 R240.1 ; R240.1 53.03,71.71 53.03,71.38 53.79,70.62 R242.2 ; R240.1 R239.1
$1N36743: length 12.3
  Top Layer w0.254: U25.9 U25.8 49.68,77.98 53.54,77.98 55.32,76.21 55.32,74.43 R240.2
$1N36755: length 22.3
  Top Layer w0.254: U25.10 46.63,76.41 46.15,75.93 44.63,75.93 42.3,73.6 41.54,73.6 40.84,72.91 40.84,67.95 43,65.79 45.28,65.79 R243.2
$1N37159: length 20.1
  Top Layer w0.254: R244.1 52.39,45.07 v1(52.45,45.01) ; SW35.3 55.25,29.77 55.25,35.48 52.58,38.15 v1(52.58,43.1)
  Bottom Layer w0.254: v1(52.58,43.1) 52.58,44.88 v1(52.45,45.01)
$1N37162: length 12.6
  Top Layer w0.254: U26.2 41.8,50.86 43.63,49.03 44.4,49.03 45.01,48.42 46.62,48.42 46.77,48.27 R245.3 48.59,47.38 R244.2
$1N37168: length 21.5
  Top Layer w0.254: R246.2 51.37,56.65 50.49,56.65 48.97,55.12 43.76,55.12 40.53,51.9 U26.1 40.84,51.18 40.84,50.3 41.66,49.48 42.68,49.48 42.87,49.29 42.87,48.78 R245.2
$1N37173: length 10
  Top Layer w0.254: R248.1 51.87,48.39 48.71,48.39 48.18,48.92 47.12,48.92 46.91,49.13 46.17,49.13 45.61,49.69 U26.5
$1N37177: length 12.4
  Top Layer w0.254: R247.1 52.01,51.26 52.01,50.93 52.78,50.17 R249.2 ; R247.1 48.23,49.92 47.06,49.92 47.06,51.31 U26.6 ; R247.1 R246.1
$1N37188: length 12.3
  Top Layer w0.254: R247.2 54.3,53.99 54.3,55.76 52.52,57.54 48.66,57.54 U26.8 U26.9
$1N37200: length 22.3
  Top Layer w0.254: U26.10 45.61,55.96 45.13,55.48 43.61,55.48 41.28,53.16 40.52,53.16 39.82,52.46 39.82,47.5 41.98,45.35 44.27,45.35 R250.2
$1N37656: length 35.1
  Top Layer w0.254: R231.1 53.2,85.52 v1(57.4,85.52)
  Bottom Layer w0.254: v1(57.4,85.52) 59.31,83.62 59.31,60.63 59.06,60.38 59.06,57.71 SW33.3
$1N37740: length 28.4
  Top Layer w0.254: v1(56.51,65.2) 53.74,65.2 R237.1
  Bottom Layer w0.254: v1(56.51,65.2) 56.39,65.08 56.39,55.3 56.64,55.04 56.77,55.04 59.18,52.63 59.18,43.36 SW34.3
$1N37992: length 4.5
  Top Layer w0.254: Q3.1 9.95,28.88 7.75,28.88 6.48,30.14 R73.1
$1N38351: length 17.7
  Top Layer w0.254: Q3.2 9.55,31.8 3.56,31.8 3.56,22.16 BUZZER1.1
$1N40250: length 17.3
  Top Layer w0.254: v1(32.38,31.8) R251.2
  Bottom Layer w0.254: LED9.3 30.48,26.54 30.48,25.71 35.94,25.71 36.32,26.09 36.32,31.17 35.94,31.55 32.64,31.55 v1(32.38,31.8)
$1N40252: length 6.7
  Top Layer w0.254: v1(29.21,31.8) R252.2
  Bottom Layer w0.254: v1(29.21,31.8) 29.46,31.8 30.48,30.78 32.51,30.78 LED9.1
$1N40254: length 10.6
  Top Layer w0.254: v1(26.67,31.67) R253.1
  Bottom Layer w0.254: v1(26.67,31.67) 28.7,29.64 32.64,29.64 32.64,28.33 33.71,27.27 LED9.4

## Copper pours and planes (outline as drawn; the poured copper is in the pictures)
GND on Top Layer: -20.7,117.02 99.82,117.02 99.82,-32.59 -20.7,-32.59
GND on Bottom Layer: -32,134.42 125.73,134.42 125.73,-51.64 -32,-51.64

## Text on the board
Bottom Silkscreen Layer: 5v | 1反相比例器 / 2同相比例器 / 3同相加法器 / 4反相加法器 / 5减法器 / 6仪用放大器 / 7积分器 / 8微分器 | 运放常用电路
Top Silkscreen Layer: 10V | -10V | IN1 | IN0 | IN2 | G | 5V | SDA | SCL | 3.3 | 电源 | IN1切换 | IN2切换 | IN0切换
